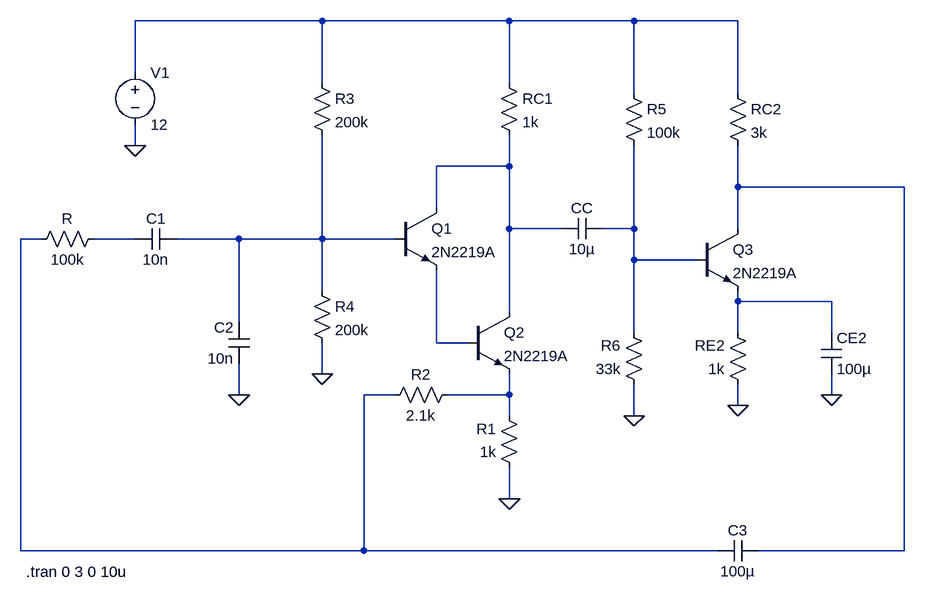
[diagram p0: schematic Wein Bridge Oscillator.asc]
Wein Bridge Oscillator.asc, the LTspice schematic file:
Version 4
SHEET 1 1256 768
WIRE 336 -96 48 -96
WIRE 624 -96 336 -96
WIRE 816 -96 624 -96
WIRE 976 -96 816 -96
WIRE 48 -16 48 -96
WIRE 336 0 336 -96
WIRE 624 0 624 -96
WIRE 816 16 816 -96
WIRE 976 16 976 -96
WIRE 48 96 48 64
WIRE 624 128 624 80
WIRE 624 128 512 128
WIRE 976 160 976 96
WIRE 1232 160 976 160
WIRE 512 192 512 128
WIRE 624 224 624 128
WIRE 704 224 624 224
WIRE 816 224 816 96
WIRE 816 224 768 224
WIRE 976 224 976 160
WIRE -96 240 -128 240
WIRE 48 240 -16 240
WIRE 208 240 112 240
WIRE 336 240 336 80
WIRE 336 240 208 240
WIRE 448 240 336 240
WIRE 816 272 816 224
WIRE 912 272 816 272
WIRE 336 320 336 240
WIRE 976 336 976 320
WIRE 1120 336 976 336
WIRE 624 352 624 224
WIRE 208 368 208 240
WIRE 816 384 816 272
WIRE 976 384 976 336
WIRE 1120 384 1120 336
WIRE 512 400 512 288
WIRE 560 400 512 400
WIRE 336 448 336 400
WIRE 208 480 208 432
WIRE 448 480 400 480
WIRE 624 480 624 448
WIRE 624 480 528 480
WIRE 1120 480 1120 448
WIRE 976 496 976 464
WIRE 624 512 624 480
WIRE 816 512 816 464
WIRE 624 640 624 592
WIRE -128 720 -128 240
WIRE 400 720 400 480
WIRE 400 720 -128 720
WIRE 944 720 400 720
WIRE 1232 720 1232 160
WIRE 1232 720 1008 720
FLAG 48 96 0
FLAG 208 480 0
FLAG 336 448 0
FLAG 1120 480 0
FLAG 816 512 0
FLAG 976 496 0
FLAG 624 640 0
SYMBOL res 320 -16 R0
SYMATTR InstName R3
SYMATTR Value 200k
SYMBOL res 0 224 R90
WINDOW 0 0 56 VBottom 2
WINDOW 3 32 56 VTop 2
SYMATTR InstName R
SYMATTR Value 100k
SYMBOL cap 112 224 R90
WINDOW 0 0 32 VBottom 2
WINDOW 3 32 32 VTop 2
SYMATTR InstName C1
SYMATTR Value 10n
SYMBOL cap 224 432 R180
WINDOW 0 24 56 Left 2
WINDOW 3 24 8 Left 2
SYMATTR InstName C2
SYMATTR Value 10n
SYMBOL res 320 304 R0
SYMATTR InstName R4
SYMATTR Value 200k
SYMBOL res 608 -16 R0
SYMATTR InstName RC1
SYMATTR Value 1k
SYMBOL cap 768 208 R90
WINDOW 0 0 32 VBottom 2
WINDOW 3 32 32 VTop 2
SYMATTR InstName CC
SYMATTR Value 10µ
SYMBOL res 800 0 R0
SYMATTR InstName R5
SYMATTR Value 100k
SYMBOL res 544 464 R90
WINDOW 0 0 56 VBottom 2
WINDOW 3 32 56 VTop 2
SYMATTR InstName R2
SYMATTR Value 2.1k
SYMBOL res 640 608 R180
WINDOW 0 36 76 Left 2
WINDOW 3 36 40 Left 2
SYMATTR InstName R1
SYMATTR Value 1k
SYMBOL res 832 480 R180
WINDOW 0 36 76 Left 2
WINDOW 3 36 40 Left 2
SYMATTR InstName R6
SYMATTR Value 33k
SYMBOL res 992 480 R180
WINDOW 0 36 76 Left 2
WINDOW 3 36 40 Left 2
SYMATTR InstName RE2
SYMATTR Value 1k
SYMBOL res 960 0 R0
SYMATTR InstName RC2
SYMATTR Value 3k
SYMBOL cap 1104 384 R0
SYMATTR InstName CE2
SYMATTR Value 100µ
SYMBOL npn 448 192 R0
SYMATTR InstName Q1
SYMATTR Value 2N2219A
SYMBOL npn 560 352 R0
SYMATTR InstName Q2
SYMATTR Value 2N2219A
SYMBOL npn 912 224 R0
SYMATTR InstName Q3
SYMATTR Value 2N2219A
SYMBOL cap 1008 704 R90
WINDOW 0 0 32 VBottom 2
WINDOW 3 32 32 VTop 2
SYMATTR InstName C3
SYMATTR Value 100µ
SYMBOL voltage 48 -32 R0
SYMATTR InstName V1
SYMATTR Value 12
TEXT -120 752 Left 2 !.tran 0 3 0 10u

The netlist it stands for:
* Wein Bridge Oscillator.asc
R3 N001 N007 200k
R N006 N005 100k
C1 N007 N006 10n
C2 0 N007 10n
R4 N007 0 200k
RC1 N001 N002 1k
CC N004 N002 10µ
R5 N001 N004 100k
R2 N010 N005 2.1k
R1 0 N010 1k
R6 0 N004 33k
RE2 0 N008 1k
RC2 N001 N003 3k
CE2 N008 0 100µ
Q1 N002 N007 N009 0 2N2219A
Q2 N002 N009 N010 0 2N2219A
Q3 N003 N004 N008 0 2N2219A
C3 N003 N005 100µ
V1 N001 0 12
.model NPN NPN
.model PNP PNP
.lib standard.bjt
.tran 0 3 0 10u
.backanno
.end